# Altium schematic sheet 1_P1.schdoc.schdoc
size 309 x 223 mm; Symbol: Sheet-Symbol_A4; Device: Sheet-Symbol_A4; Company: ������EDA; Version: V1.0; Page Size: A4; @Project Name: XH-DOWNLOAD; @Page Count: 1; @Update Date: 2024-03-22; @Create Date: 2024-03-22; @Schematic Name: Schematic1; @Page No: 1; @Page Name: P1
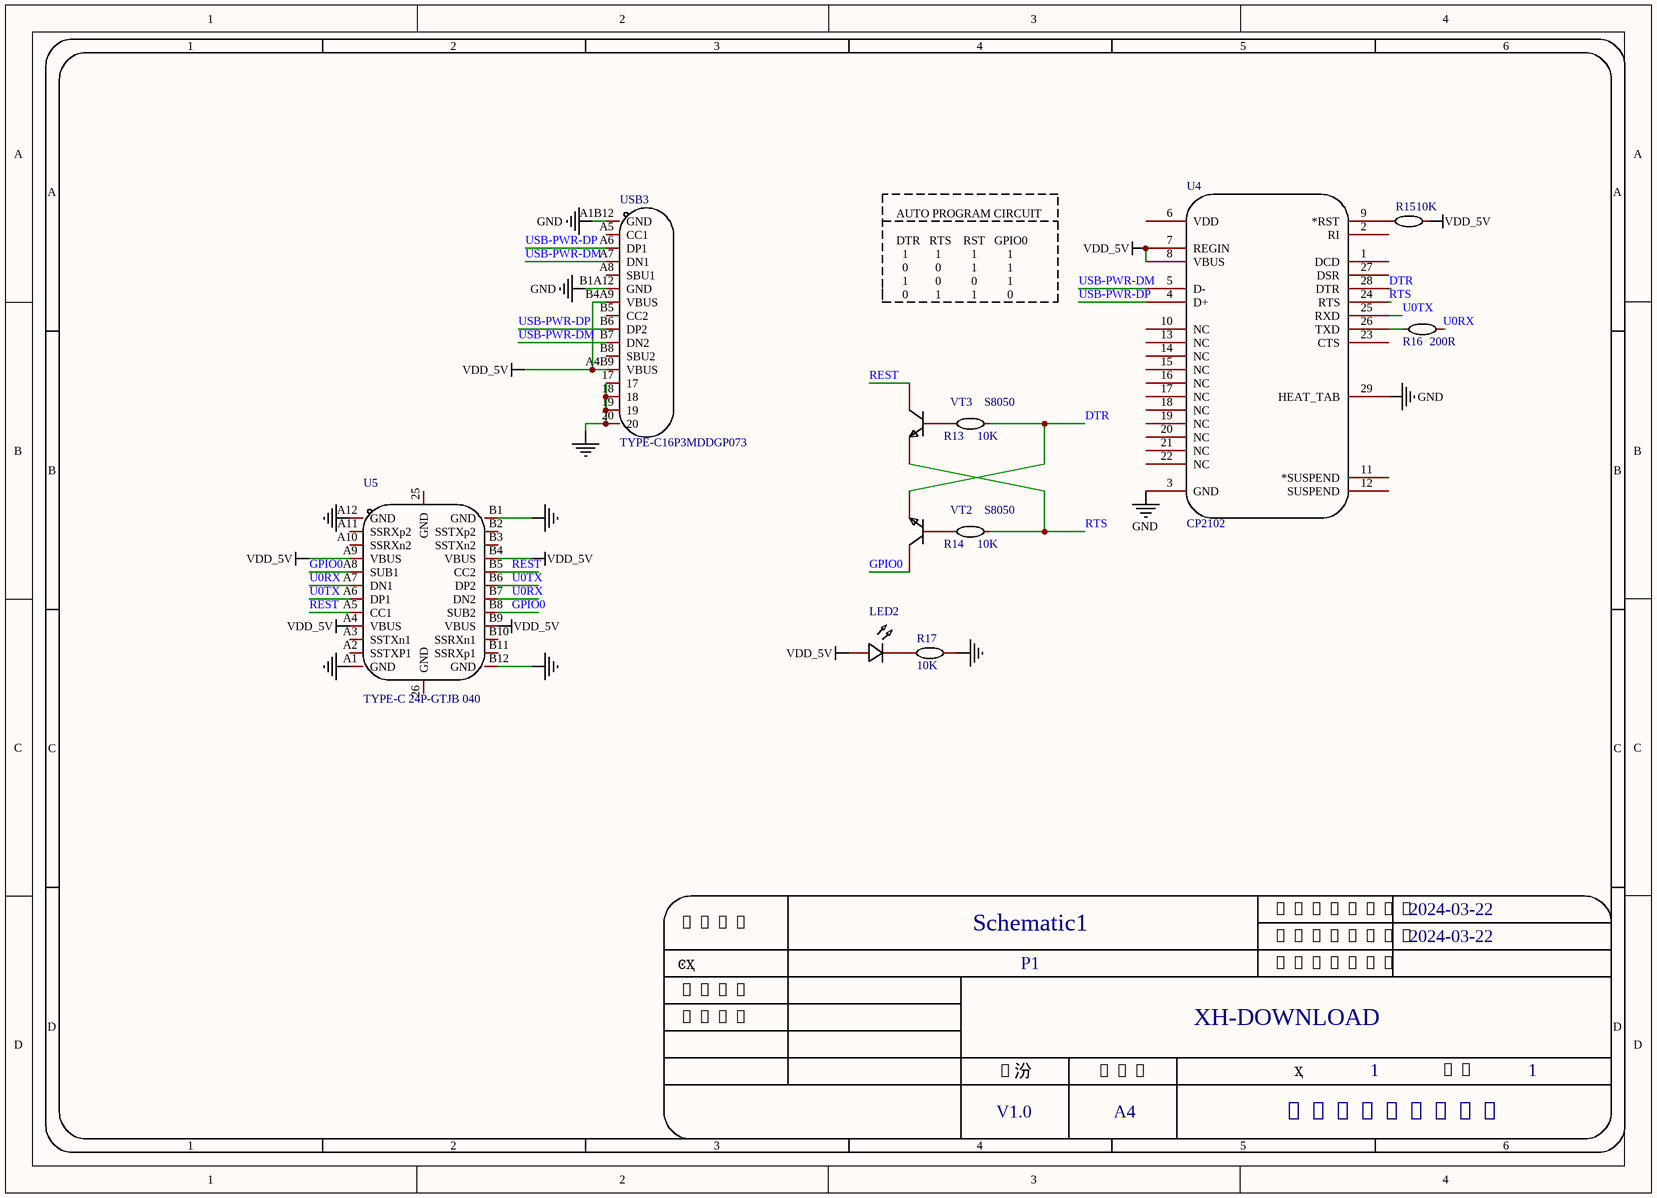
[diagram p0: 1_P1.schdoc.schdoc]

## Parts
LED2  LED_0603-R  [LED_0603]  (value not drawn)
R13  10K  [C-0402]
R14  10K  [C-0402]
R15  10K  [C-0402]
R16  200R  [C-0402]
R17  10K  [R0603]
U4  CP2102  [QFN28]
U5  TYPE-C 24P-GTJB 040  [USB-C-SMD_TYPE-C-24P-GTJB-040]
USB3  TYPE-C16P3MDDGP073  [USB-SMD_TYPE-C16PIN-1]
VT2  S8050  [SOT-233]
VT3  S8050  [SOT-233]

## Nets
GND: U4.3(GND) U4.29(HEAT_TAB) USB3.17 USB3.18 USB3.19 USB3.20 USB3.A1B12(GND) USB3.B1A12(GND)
NetR17_2: R17.2 U5.A1(GND) U5.A12(GND) U5.B1(GND) U5.B12(GND)
VDD_5V: LED2.2(A) R15.1 U4.7(REGIN) U4.8(VBUS) U5.A4(VBUS) U5.A9(VBUS) U5.B4(VBUS) U5.B9(VBUS) USB3.A4B9(VBUS) USB3.B4A9(VBUS)
DTR: R13.1 U4.28(DTR) VT2.2(E)
GPIO0: U5.A8(SUB1) U5.B8(SUB2) VT2.3(C)
REST: U5.A5(CC1) U5.B5(CC2) VT3.3(C)
RTS: R14.1 U4.24(RTS) VT3.2(E)
U0RX: R16.1 U5.A7(DN1) U5.B7(DN2)
U0TX: U4.25(RXD) U5.A6(DP1) U5.B6(DP2)
USB-PWR-DM: U4.5(D-) USB3.A7(DN1) USB3.B7(DN2)
USB-PWR-DP: U4.4(D+) USB3.A6(DP1) USB3.B6(DP2)
NetLED2_1: LED2.1(C) R17.1
NetR13_2: R13.2 VT3.1(B)
NetR14_2: R14.2 VT2.1(B)
NetR15_2: R15.2 U4.9(*RST)
NetR16_2: R16.2 U4.26(TXD)

Not connected (* = marked no-connect by the designer): U4 1(DCD) 2(RI) 6(VDD) 10(NC) 11(*SUSPEND) 12(SUSPEND) 13(NC) 14(NC) 15(NC) 16(NC) 17(NC) 18(NC) 19(NC) 20(NC) 21(NC) 22(NC) 23(CTS) 27(DSR); U5 25(GND) 26(GND) A2(SSTXP1) A3(SSTXn1) A10(SSRXn2) A11(SSRXp2) B2(SSTXp2) B3(SSTXn2) B10(SSRXn1) B11(SSRXp1); USB3 A5(CC1) A8(SBU1) B5(CC2) B8(SBU2)

## Notes on the sheet
- AUTO PROGRAM CIRCUIT
  DTR   RTS    RST   GPIO0
  1         1          1          1
  0         0          1          1
  1         0          0          1
  0         1          1          0
- 1
- 2
- 3
- 4
- 5
- 6
- A
- B
- C
- ԭ��ͼ
- Schematic1
- ��������
- 2024-03-22
- ����
- ͼҳ
- P1
- ���ϱ���
- XH-DOWNLOAD
- D
- �汾
- �ߴ�
- ҳ
- ��
- V1.0
- A4
- ������EDA

## Library data of the parts
LED2 = LED_0603-R: Symbol: LED_R; Convert to PCB: yes; Device: LED_0603-R; Add into BOM: yes; Supplier Footprint: 0603
R13 R14 = 12K: Resistor; Symbol: ����-0402; Add into BOM: yes; Name: 10K; Device: 12K; Value: 10K; Convert to PCB: yes; Origin Footprint: C-0402; Design Item ID: ����-0402; Library Name: MyPcbLib
R15 = 10K: Resistor; Symbol: ����-0402; Value: 22R; Add into BOM: yes; Name: 10K; Device: 10K; Convert to PCB: yes; Origin Footprint: C-0402; Design Item ID: ����-0402; Library Name: MyPcbLib
R16 = 200R: Resistor; Symbol: ����-0402; Value: 22R; Add into BOM: yes; Name: 200R; Device: 200R; Convert to PCB: yes; Origin Footprint: C-0402; Design Item ID: ����-0402; Library Name: MyPcbLib
R17 = Res_0603: Symbol: ����; Convert to PCB: yes; Name: 10K; Device: Res_0603; Add into BOM: yes; Supplier Footprint: 0603; Value: 10K
U4 = CP2102: USB转TTL; PART DESC: SINGLE-CHIP USB TO UART BRIDGE, QFN28, RoHS.; MFG #1: SILICON LABS; Add into BOM: yes; Name: CP2102; Symbol: CP2102; Device: CP2102; PART NUMBER: CP2102; Value: Value; Type: DEV; Convert to PCB: yes; Origin Footprint: QFN28; Design Item ID: CP2102; Library Name: mLib
U5 = TYPE-C 24P-GTJB 040: Manufacturer: SHOU HAN(�׺�); Add into BOM: yes; Gender: ��; Number of Ports: 1; Number of Contacts: 24P; Current Rating - Power (Max): 3A; Name: TYPE-C 24P-GTJB 040; Symbol: TYPE-C 24P-GTJB 040; Device: TYPE-C 24P-GTJB 040; LCSC Part Name: Type-C �� �а�; Supplier Part: C3151751; Manufacturer Part: TYPE-C 24P-GTJB 040; Supplier Footprint: SMD; JLCPCB Part Class: ��չ��; Datasheet: https://atta.szlcsc.com/upload/public/pdf/source/20220627/7E6A801537BBF5FC92E560D05DD164AC.pdf; Supplier: LCSC; Convert to PCB: yes; Connector Type: Type-C; Standard: -; Mounting Style: �а�; Contact Material: -; Contact Plating: -; Operating Temperature Range: -40��~+85��; Soldering Temperature(Max): -
USB3 = TYPE-C16P3MDDGP073: Manufacturer: SHOU HAN(�׺�); Add into BOM: yes; Connector Type: Type-C; Gender: ĸ��; Number of Contacts: 16; Number of Ports: 1; Current Rating - Power (Max): 5A; Name: TYPE-C16P3MDDGP073; Symbol: TYPE-C16P3MDDGP073; Device: TYPE-C16P3MDDGP073; LCSC Part Name: Type-C ĸ�� ����; Supplier Part: C2965608; Manufacturer Part: TYPE-C16P3MDDGP073; Supplier Footprint: SMD; JLCPCB Part Class: Extended Part; Datasheet: https://atta.szlcsc.com/upload/public/pdf/source/20220407/B6CD8216925DA366D8140ABDDF4F46D3.pdf; Supplier: LCSC; Convert to PCB: yes; Standard: -; Mounting Style: ����; Contact Material: -; Contact Plating: -; Operating Temperature Range: -25��~+85��; Welding Temperature (Max): -
VT2 VT3 = S8050: Surface mount NPN transistor, package SOT-23; Symbol: SMT_TRIODE_NPN; Add into BOM: yes; Name: S8050; Device: S8050; Convert to PCB: yes; Origin Footprint: SOT-233; Design Item ID: SMT_TRIODE_NPN; Library Name: MyPcbLib